# Altium schematic sheet main.SchDoc
size A3; SheetNumber: 1; SheetTotal: 1
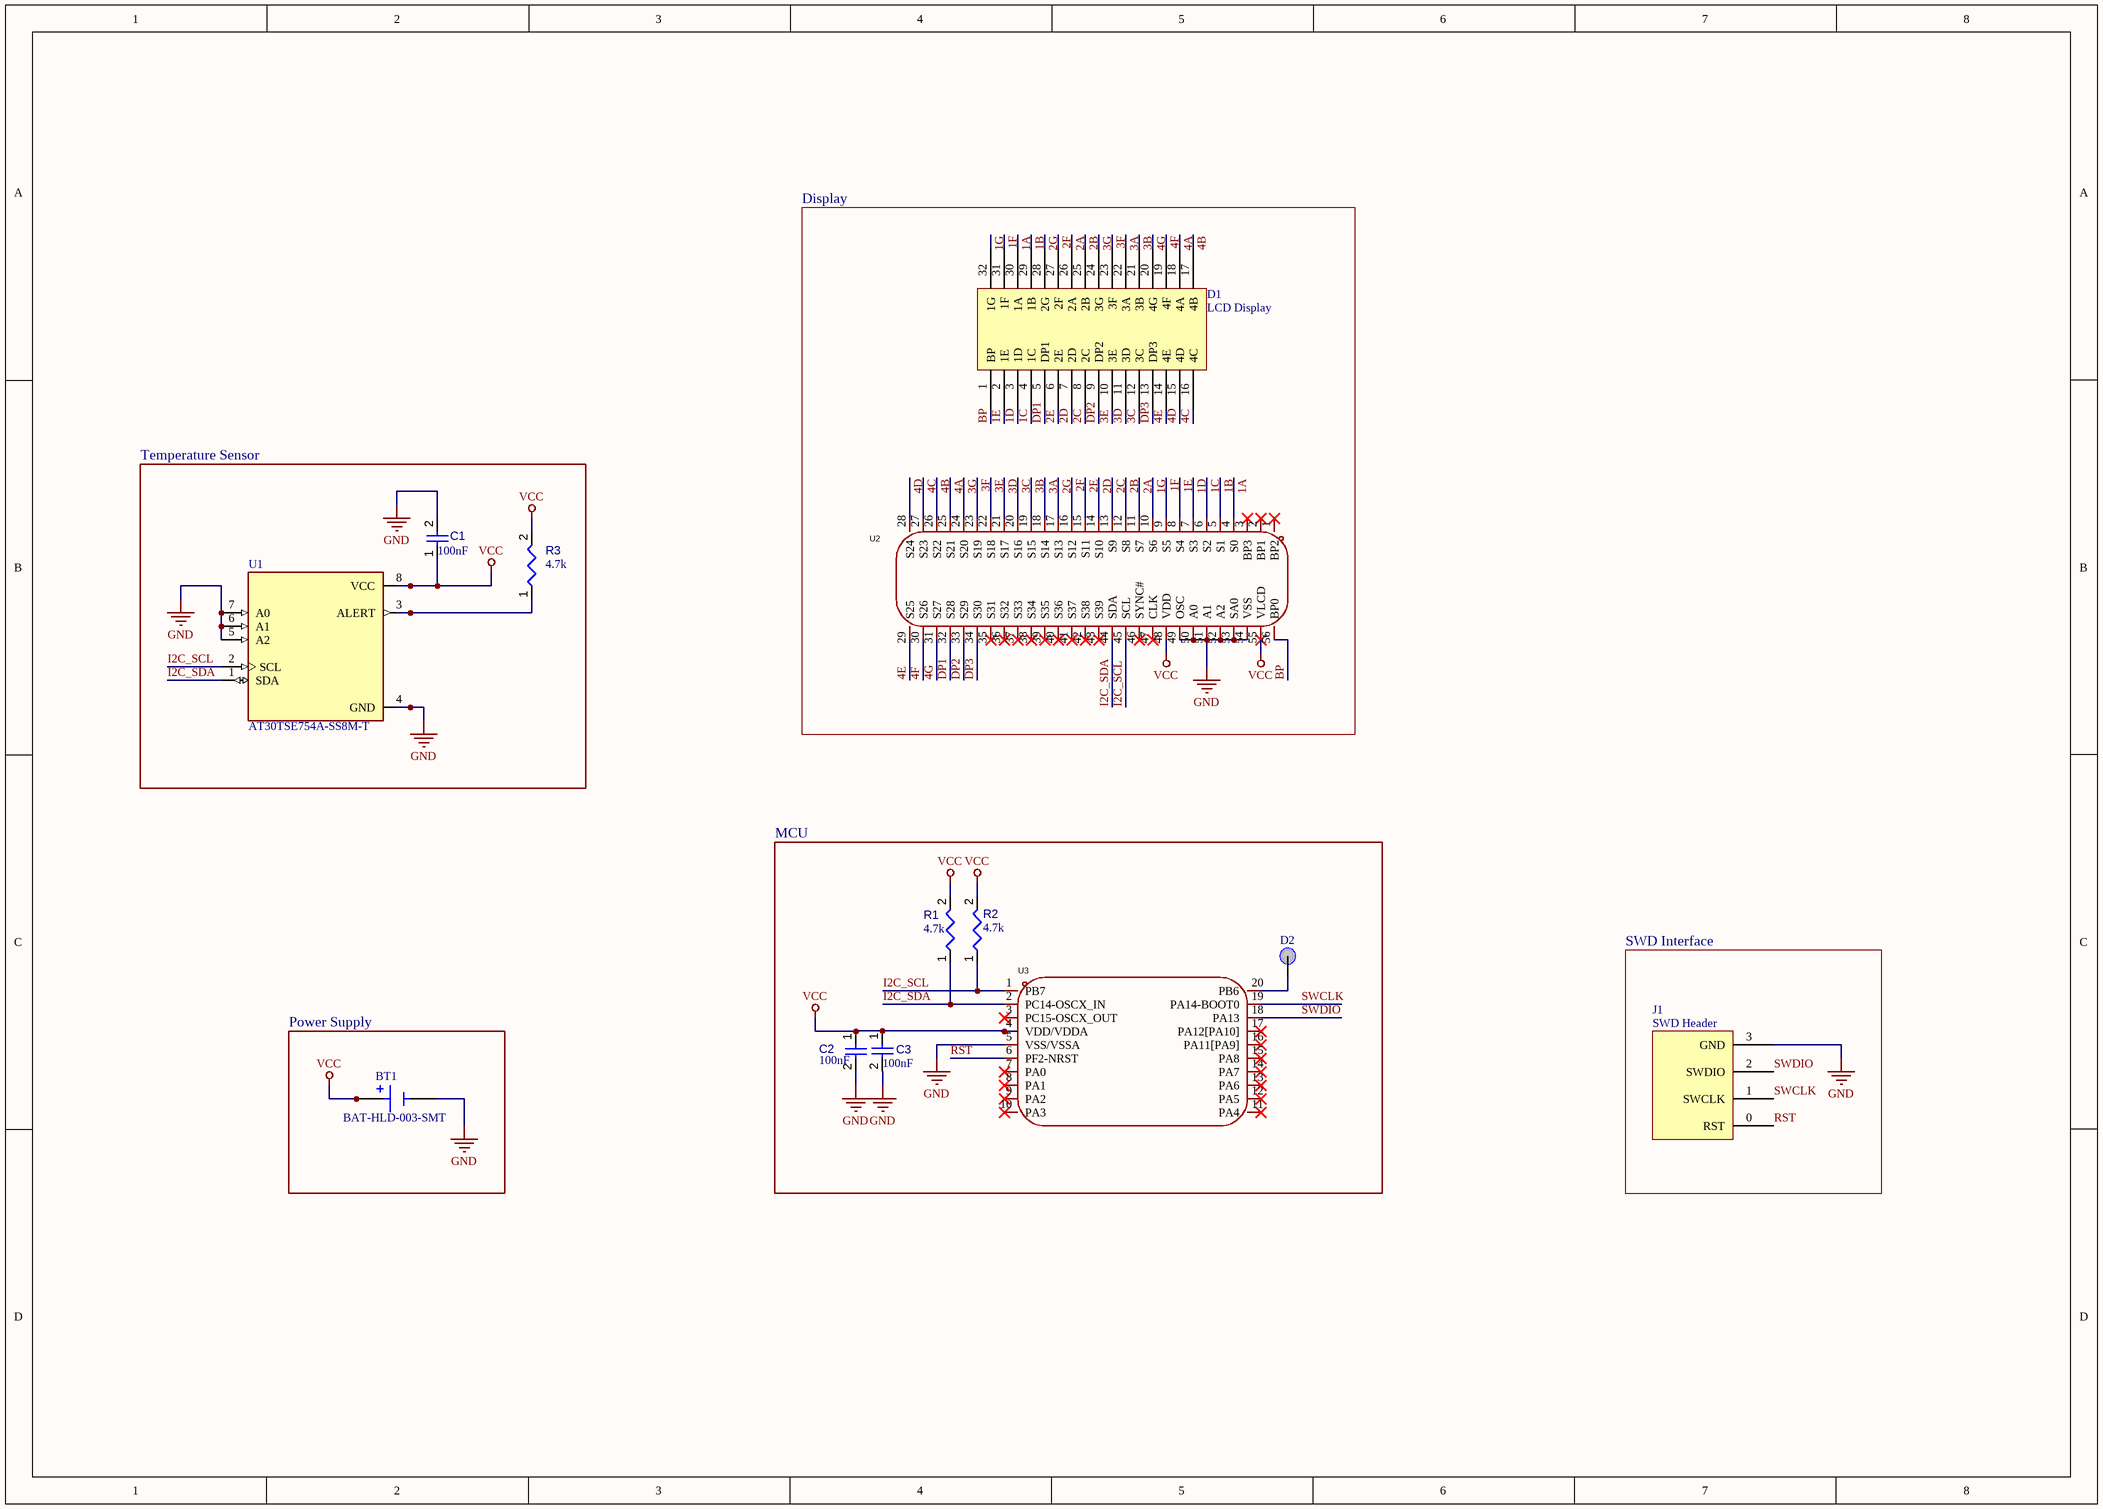
[diagram p0: main.SchDoc]

## Parts
BT1  BAT-HLD-003-SMT  [BAT_BAT-HLD-003-SMT]
C1  value 100nF  [CAPC2013X95X50LL10T25]  (hidden comment: Capacitor 100 nF +/-10% 50 V 0805)
C2  value 100nF  [CAPC2013X95X50LL10T25]  (hidden comment: Capacitor 100 nF +/-10% 50 V 0805)
C3  value 100nF  [CAPC2013X95X50LL10T25]  (hidden comment: Capacitor 100 nF +/-10% 50 V 0805)
D1  LCD Display  [DE117RS2075V]
D2  Test Via  [Test Via]  (value not drawn)
J1  SWD Header  [4-Pin Header TH]
R1  value 4.7k  [RESC2013X70X40ML20T20]  (hidden comment: Resistor 4k7 +/-1% 0805 125 mW)
R2  value 4.7k  [RESC2013X70X40ML20T20]  (hidden comment: Resistor 4k7 +/-1% 0805 125 mW)
R3  value 4.7k  [RESC2013X70X40ML20T20]  (hidden comment: Resistor 4k7 +/-1% 0805 125 mW)
U1  AT30TSE754A-SS8M-T  [SOIC127P599X175-8N]
U2  PCF85176T/1Y  [TSSOP-56_L14.0-W6.1-P0.50-LS8.1-BL]  (value not drawn)
U3  STM32C011F6P6  [TSSOP-20_L6.5-W4.4-P0.65-LS6.4-BL]  (value not drawn)

## Blocks framed on the sheet
Display: D1 U2
Temperature Sensor: C1 R3 U1
MCU: C2 C3 D2 R1 R2 U3
SWD Interface: J1
Power Supply: BT1

## Nets
GND: BT1.N(NEG) C1.2 C2.2 C3.2 J1.3(GND) U1.4(GND) U1.5(A2) U1.6(A1) U1.7(A0) U2.49(OSC) U2.50(A0) U2.51(A1) U2.52(A2) U2.53(SA0) U2.54(VSS) U3.5(VSS/VSSA)
VCC: BT1.P1(POS) BT1.P2(POS) C1.1 C2.1 C3.1 R1.2 R2.2 R3.2 U1.8(VCC) U2.48(VDD) U2.55(VLCD) U3.4(VDD/VDDA)
1A: D1.30(1A) U2.4(S0)
1B: D1.29(1B) U2.5(S1)
1C: D1.4(1C) U2.6(S2)
1D: D1.3(1D) U2.7(S3)
1E: D1.2(1E) U2.8(S4)
1F: D1.31(1F) U2.9(S5)
1G: D1.32(1G) U2.10(S6)
2A: D1.26(2A) U2.11(S7)
2B: D1.25(2B) U2.12(S8)
2C: D1.8(2C) U2.13(S9)
2D: D1.7(2D) U2.14(S10)
2E: D1.6(2E) U2.15(S11)
2F: D1.27(2F) U2.16(S12)
2G: D1.28(2G) U2.17(S13)
3A: D1.22(3A) U2.18(S14)
3B: D1.21(3B) U2.19(S15)
3C: D1.12(3C) U2.20(S16)
3D: D1.11(3D) U2.21(S17)
3E: D1.10(3E) U2.22(S18)
3F: D1.23(3F) U2.23(S19)
3G: D1.24(3G) U2.24(S20)
4A: D1.18(4A) U2.25(S21)
4B: D1.17(4B) U2.26(S22)
4C: D1.16(4C) U2.27(S23)
4D: D1.15(4D) U2.28(S24)
4E: D1.14(4E) U2.29(S25)
4F: D1.19(4F) U2.30(S26)
4G: D1.20(4G) U2.31(S27)
BP: D1.1(BP) U2.56(BP0)
DP1: D1.5(DP1) U2.32(S28)
DP2: D1.9(DP2) U2.33(S29)
DP3: D1.13(DP3) U2.34(S30)
I2C_SCL: R2.1 U1.2(SCL) U2.45(SCL) U3.1(PB7)
I2C_SDA: R1.1 U1.1(SDA) U2.44(SDA) U3.2(PC14-OSCX_IN)
RST: J1.0(RST) U3.6(PF2-NRST)
SWCLK: J1.1(SWCLK) U3.19(PA14-BOOT0)
SWDIO: J1.2(SWDIO) U3.18(PA13)
NetD2_1: D2.1 U3.20(PB6)
NetR3_1: R3.1 U1.3(ALERT)

Not connected (* = marked no-connect by the designer): U2 1(BP2)* 2(BP1)* 3(BP3)* 35(S31)* 36(S32)* 37(S33)* 38(S34)* 39(S35)* 40(S36)* 41(S37)* 42(S38)* 43(S39)* 46(SYNC#)* 47(CLK)*; U3 3(PC15-OSCX_OUT)* 7(PA0)* 8(PA1)* 9(PA2)* 10(PA3)* 11(PA4)* 12(PA5)* 13(PA6)* 14(PA7)* 15(PA8)* 16(PA11[PA9])* 17(PA12[PA10])*

## Library data of the parts
BT1 = BAT-HLD-003-SMT: Battery Holder Coin 20 SMT Nickel; MF: Linx Technologies Inc.; SnapEDA_Link: https://www.snapeda.com/parts/BAT-HLD-003-SMT/Linx/view-part/?ref=snap; Package: None; Value: *; MP: BAT-HLD-003-SMT; Check_prices: https://www.snapeda.com/parts/BAT-HLD-003-SMT/Linx/view-part/?ref=eda; ComponentLink1Description: Datsheet; ComponentLink1URL: https://www.te.com/commerce/DocumentDelivery/DDEController?Action=srchrtrv&DocNm=BAT-HLD-003-SMT-TR&DocType=Data+Sheet&DocLang=English&DocFormat=pdf&PartCntxt=BAT-HLD-003-SMT-TR
C1-C3 = CMP-001-00018-6: Chip Capacitor, 100 nF, +/- 10%, 50 V, 0805 (2012 Metric); Capacitor Type: Ceramic; Voltage Rating: 50V; Pins: 2; Max Operating Temperature: 125°C; Min Operating Temperature: -55°C; Mounting Technology: SM; Case/Package: 0805; RoHS Compliant: True; Tolerance: 10%
D1 = DE117RS21: A 4 digit LCD Display with 4 Backplanes and no Backlight running at very low current (2uA/cm^2); ComponentLink1Description: Datasheet; ComponentLink1URL: https://cdn-reichelt.de/documents/datenblatt/C700/DE117RS2075.pdf
D2 = Test Via: Test via hole
R1-R3 = CMP-009-00032-5: Chip Resistor, 4.7 KOhm, +/- 1%, 0.125 W, -55 to 155 degC, 0805 (2012 Metric); Power: 125mW; Voltage Rating: 150V; Max Operating Temperature: 155°C; Min Operating Temperature: -55°C; Case/Package: 0805; RoHS Compliant: True; Pins: 2; Tolerance: 1%; Mounting Technology: SM
U1 = AT30TSE754A-SS8M-T: Temperature Sensor; Package: None; Price: None; Value: *; MP: AT30TSE754A-SS8M-T; Availability: Unavailable; ComponentLink1Description: Datasheet; ComponentLink1URL: https://cdn-reichelt.de/documents/datenblatt/A200/AT30TSE752A-SS8M-B_ENG_TDS.pdf
U2 = PCF85176T/1Y: 40x4 Universal LCD Driver; Manufacturer: NXP(恩智浦); Add into BOM: yes; Display Configurations: 40段; Operating Voltage: 1.8V~5.5V; Interface: I2C; Operating Current: 3.5uA; Symbol: PCF85176T/1Y; Device: PCF85176T/1Y; LCSC Part Name: PCF85176T/1Y; Supplier Part: C3194505; Manufacturer Part: PCF85176T/1Y; Supplier Footprint: TFSOP-56-6.1mm; JLCPCB Part Class: Extended Part; Datasheet: https://www.mouser.de/datasheet/2/302/PCF85176-2539777.pdf; Supplier: LCSC; Convert to PCB: yes; Operating Temperature: -40℃~+85℃; ComponentLink1Description: Datasheet; ComponentLink1URL: https://www.mouser.de/datasheet/2/302/PCF85176-2539777.pdf
U3 = STM32C011F6P6: Microcontroller; Manufacturer: ST(意法半导体); Add into BOM: yes; Symbol: STM32C011F6P6; Device: STM32C011F6P6; LCSC Part Name: STM32C011F6P6; Supplier Part: C5456198; Manufacturer Part: STM32C011F6P6; Supplier Footprint: TSSOP-20; JLCPCB Part Class: Extended Part; Datasheet: https://www.st.com/resource/en/datasheet/stm32c011d6.pdf; Supplier: LCSC; Convert to PCB: yes; ComponentLink1Description: Datasheet; ComponentLink1URL: https://www.st.com/resource/en/datasheet/stm32c011d6.pdf